# Altium project GBxProg.PrjPcb
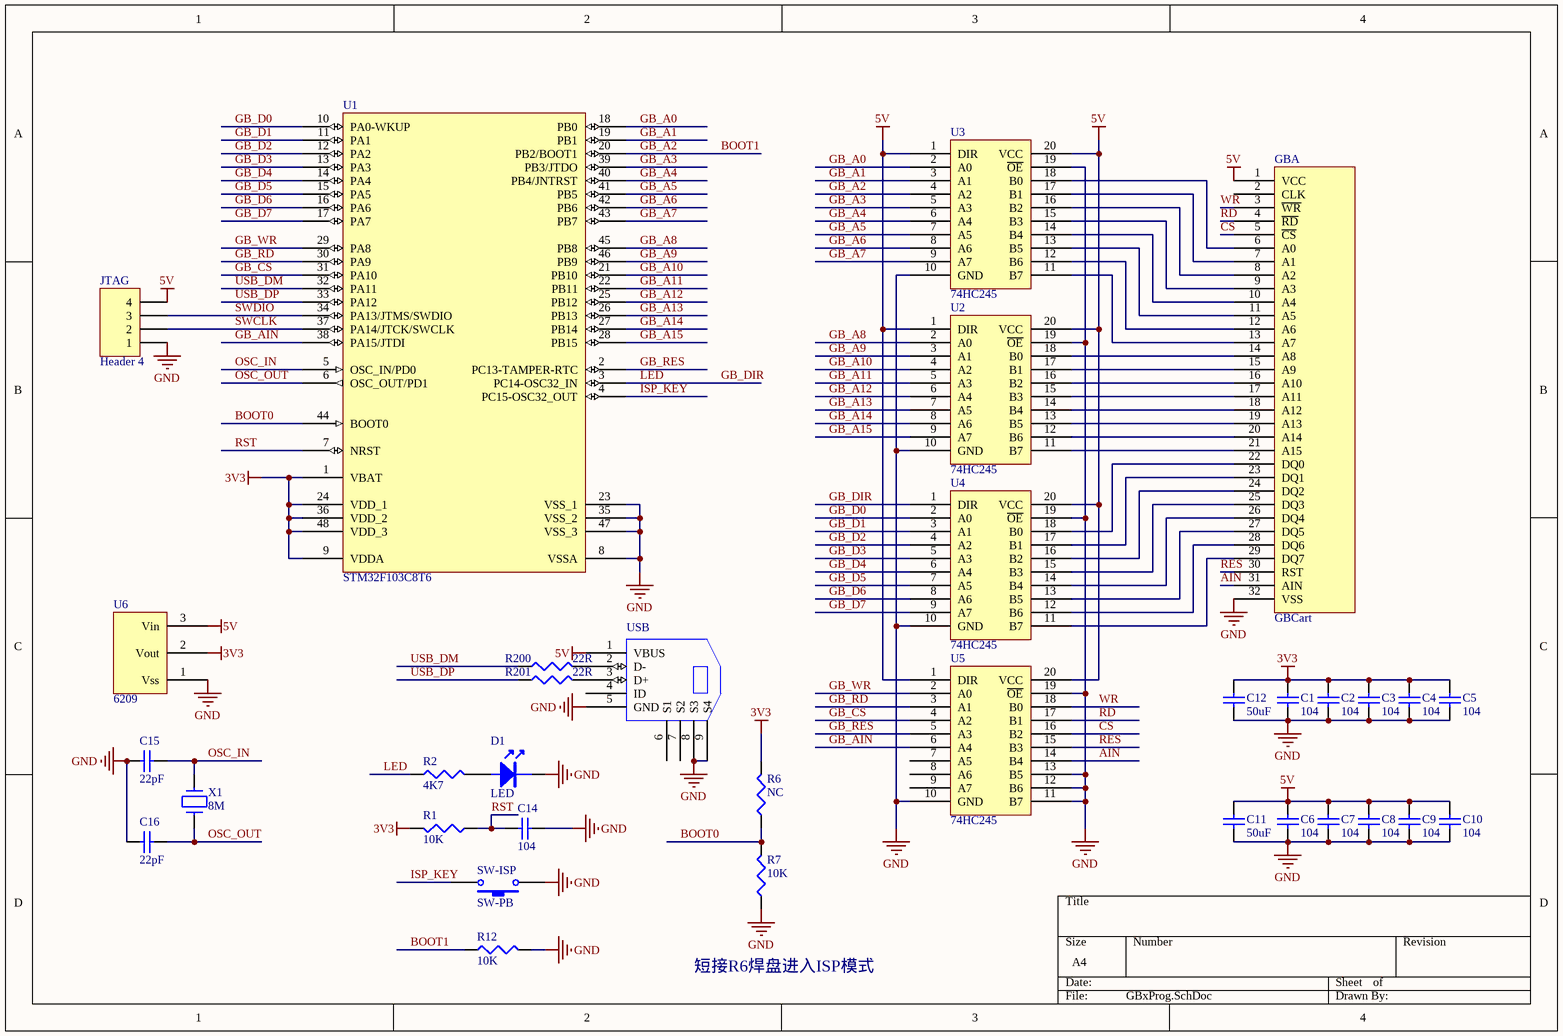
[diagram p0: GBxProg.SchDoc]
1 sheet, 34 parts. Net scope: global (net labels, ports and power ports of the same name join across sheets).
Board file: GBxProg.PcbDoc

## Sheet GBxProg.SchDoc
size A4

### Parts
C1  104  [1608[0603]]
C2  104  [1608[0603]]
C3  104  [1608[0603]]
C4  104  [1608[0603]]
C5  104  [1608[0603]]
C6  104  [1608[0603]]
C7  104  [1608[0603]]
C8  104  [1608[0603]]
C9  104  [1608[0603]]
C10  104  [1608[0603]]
C11  50uF  [C1206]
C12  50uF  [C1206]
C14  104  [1608[0603]]
C15  22pF  [1608[0603]]
C16  22pF  [1608[0603]]
D1  LED  [0805D]
GBA  GBCart  [GB_CART_1]
JTAG  Header 4  [HDR1X4]
R1  10K  [J1-0603]
R2  4K7  [J1-0603]
R6  NC  [J1-0603]
R7  10K  [J1-0603]
R12  10K  [J1-0603]
R200  22R  [J1-0603]
R201  22R  [J1-0603]
SW-ISP  SW-PB  [SOP2]
U1  STM32F103C8T6  [LQFP48_N]
U2  74HC245  [TSSOP20]
U3  74HC245  [TSSOP20]
U4  74HC245  [TSSOP20]
U5  74HC245  [TSSOP20]
U6  6209  [SOT-23]
USB  USB-MINIAB  [USB-MICRO]  (value not drawn)
X1  8M  [49S]

### Nets
3V3: C1.2 C2.2 C3.2 C4.2 C5.2 C12.2 R1.2 R6.2 U1.1(VBAT) U1.9(VDDA) U1.24(VDD_1) U1.36(VDD_2) U1.48(VDD_3) U6.2(Vout)
5V: C6.2 C7.2 C8.2 C9.2 C10.2 C11.2 GBA.1(VCC) JTAG.4 U2.1(DIR) U2.20(VCC) U3.1(DIR) U3.20(VCC) U4.20(VCC) U5.1(DIR) U5.20(VCC) U6.3(Vin) USB.1(VBUS)
GND: C1.1 C2.1 C3.1 C4.1 C5.1 C6.1 C7.1 C8.1 C9.1 C10.1 C11.1 C12.1 C14.1 C15.2 C16.2 D1.K GBA.32(VSS) JTAG.1 R7.1 R12.2 SW-ISP.1 U1.8(VSSA) U1.23(VSS_1) U1.35(VSS_2) U1.47(VSS_3) U2.10(GND) U2.19(~{OE}) U3.10(GND) U3.19(~{OE}) U4.10(GND) U4.19(~{OE}) U5.10(GND) U5.11(B7) U5.12(B6) U5.13(B5) U5.19(~{OE}) U6.1(Vss) USB.5(GND) USB.8(S3) USB.9(S4)
AIN: GBA.31(AIN) U5.14(B4)
BOOT0: R6.1 R7.2 U1.44(BOOT0)
BOOT1: R12.1 U1.20(PB2/BOOT1) U3.4(A2)  [also labelled GB_A2]
CS: GBA.5(~{CS}) U5.16(B2)
GB_A0: U1.18(PB0) U3.2(A0)
GB_A1: U1.19(PB1) U3.3(A1)
GB_A3: U1.39(PB3/JTDO) U3.5(A3)
GB_A4: U1.40(PB4/JNTRST) U3.6(A4)
GB_A5: U1.41(PB5) U3.7(A5)
GB_A6: U1.42(PB6) U3.8(A6)
GB_A7: U1.43(PB7) U3.9(A7)
GB_A8: U1.45(PB8) U2.2(A0)
GB_A9: U1.46(PB9) U2.3(A1)
GB_A10: U1.21(PB10) U2.4(A2)
GB_A11: U1.22(PB11) U2.5(A3)
GB_A12: U1.25(PB12) U2.6(A4)
GB_A13: U1.26(PB13) U2.7(A5)
GB_A14: U1.27(PB14) U2.8(A6)
GB_A15: U1.28(PB15) U2.9(A7)
GB_AIN: U1.38(PA15/JTDI) U5.6(A4)
GB_CS: U1.31(PA10) U5.4(A2)
GB_D0: U1.10(PA0-WKUP) U4.2(A0)
GB_D1: U1.11(PA1) U4.3(A1)
GB_D2: U1.12(PA2) U4.4(A2)
GB_D3: U1.13(PA3) U4.5(A3)
GB_D4: U1.14(PA4) U4.6(A4)
GB_D5: U1.15(PA5) U4.7(A5)
GB_D6: U1.16(PA6) U4.8(A6)
GB_D7: U1.17(PA7) U4.9(A7)
GB_DIR: R2.1 U1.3(PC14-OSC32_IN) U4.1(DIR)  [also labelled LED]
GB_RD: U1.30(PA9) U5.3(A1)
GB_RES: U1.2(PC13-TAMPER-RTC) U5.5(A3)
GB_WR: U1.29(PA8) U5.2(A0)
ISP_KEY: SW-ISP.2 U1.4(PC15-OSC32_OUT)
OSC_IN: C15.1 U1.5(OSC_IN/PD0) X1.2
OSC_OUT: C16.1 U1.6(OSC_OUT/PD1) X1.1
RD: GBA.4(~{RD}) U5.17(B1)
RES: GBA.30(RST) U5.15(B3)
RST: C14.2 R1.1 U1.7(NRST)
SWCLK: JTAG.2 U1.37(PA14/JTCK/SWCLK)
SWDIO: JTAG.3 U1.34(PA13/JTMS/SWDIO)
USB_DM: R200.1 U1.32(PA11)
USB_DP: R201.1 U1.33(PA12)
WR: GBA.3(~{WR}) U5.18(B0)
NetD1_A: D1.A R2.2
NetGBA_6: GBA.6(A0) U3.18(B0)
NetGBA_7: GBA.7(A1) U3.17(B1)
NetGBA_8: GBA.8(A2) U3.16(B2)
NetGBA_9: GBA.9(A3) U3.15(B3)
NetGBA_10: GBA.10(A4) U3.14(B4)
NetGBA_11: GBA.11(A5) U3.13(B5)
NetGBA_12: GBA.12(A6) U3.12(B6)
NetGBA_13: GBA.13(A7) U3.11(B7)
NetGBA_14: GBA.14(A8) U2.18(B0)
NetGBA_15: GBA.15(A9) U2.17(B1)
NetGBA_16: GBA.16(A10) U2.16(B2)
NetGBA_17: GBA.17(A11) U2.15(B3)
NetGBA_18: GBA.18(A12) U2.14(B4)
NetGBA_19: GBA.19(A13) U2.13(B5)
NetGBA_20: GBA.20(A14) U2.12(B6)
NetGBA_21: GBA.21(A15) U2.11(B7)
NetGBA_22: GBA.22(DQ0) U4.18(B0)
NetGBA_23: GBA.23(DQ1) U4.17(B1)
NetGBA_24: GBA.24(DQ2) U4.16(B2)
NetGBA_25: GBA.25(DQ3) U4.15(B3)
NetGBA_26: GBA.26(DQ4) U4.14(B4)
NetGBA_27: GBA.27(DQ5) U4.13(B5)
NetGBA_28: GBA.28(DQ6) U4.12(B6)
NetGBA_29: GBA.29(DQ7) U4.11(B7)
NetR200_2: R200.2 USB.2(D-)
NetR201_2: R201.2 USB.3(D+)

Not connected (* = marked no-connect by the designer): GBA 2(CLK); U5 7(A5) 8(A6) 9(A7); USB 4(ID) 6(S1) 7(S2)

### Notes on the sheet
- 短接R6焊盘进入ISP模式

### Library data of the parts
C1-C12 = Cap Semi: Capacitor (Semiconductor SIM Model); Value: 100pF; Published: 8-Jun-2000; LatestRevisionDate: 29-May-2009; LatestRevisionNote: IPC-7351 Footprint Added.; PackageReference: C1206; Publisher: Altium Limited; PackageDescription: Chip Capacitor
C14-C16 = Cap Semi: Capacitor (Semiconductor SIM Model); Published: 8-Jun-2000; LatestRevisionDate: 29-May-2009; LatestRevisionNote: IPC-7351 Footprint Added.; PackageReference: C1206; Publisher: Altium Limited; PackageDescription: Chip Capacitor
  C14: Value: 104
  C15 C16: Value: 22pF
JTAG = Header 4: Header, 4-Pin; LatestRevisionDate: 17-Jul-2002; LatestRevisionNote: Re-released for DXP Platform.; Publisher: Altium Limited
R1 R200 R201 = Res3: Resistor; Published: 8-Jun-2000; LatestRevisionDate: 29-May-2009; LatestRevisionNote: IPC-7351 Footprint Added.; PackageReference: J1-0603; Publisher: Altium Limited; PackageDescription: Chip Resistor
  R1: Value: 10K
  R200 R201: Value: 22R
R2 R6 R7 = Res3: Resistor; Value: 1K; Published: 8-Jun-2000; LatestRevisionDate: 29-May-2009; LatestRevisionNote: IPC-7351 Footprint Added.; PackageReference: J1-0603; Publisher: Altium Limited; PackageDescription: Chip Resistor
R12 = Res3: Resistor; Value: 0R; Published: 8-Jun-2000; LatestRevisionDate: 29-May-2009; LatestRevisionNote: IPC-7351 Footprint Added.; PackageReference: J1-0603; Publisher: Altium Limited; PackageDescription: Chip Resistor
SW-ISP = SW-PB: Switch; Published: 24-Mar-1999; LatestRevisionDate: 17-Jul-2002; LatestRevisionNote: Re-released for DXP Platform.; PackageReference: SPST-2; Publisher: Altium Limited; PackageDescription: Switch; 2 Leads
U1 = STM32F103C8T6: STM32 ARM-based 32-bit MCU with 64 Kbytes Flash, 48-pin LQFP, Industrial Temperature; Published: *; DatasheetVersion: *; PackageVersion: *; PackageReference: *; Publisher: *; PackageDescription: *; ComponentLink1Description: *; ComponentLink1URL: *; ComponentLink2Description: *; ComponentLink2URL: *
USB = USB-MINIAB: PCB DECAL: HIROSE-US60B-MB-5ST; Source_Path: Z:\ORCAD\CONNECTOR.OLB; Value: miniAB
X1 = CRYSTAL